# EasyEDA Pro project 基于VL6180的接近检测系统设计.eprj

# Schematic VL6180驱动板
Create Date: 2023-04-27; Page Name: 2/2; Project Name: 基于VL6180的接近检测系统设计; Schematic Name: VL6180驱动板; Update Date: 2023-05-16; Company: 高生洋; Drawed: B19030405; Page Size: A4; Version: V1.0
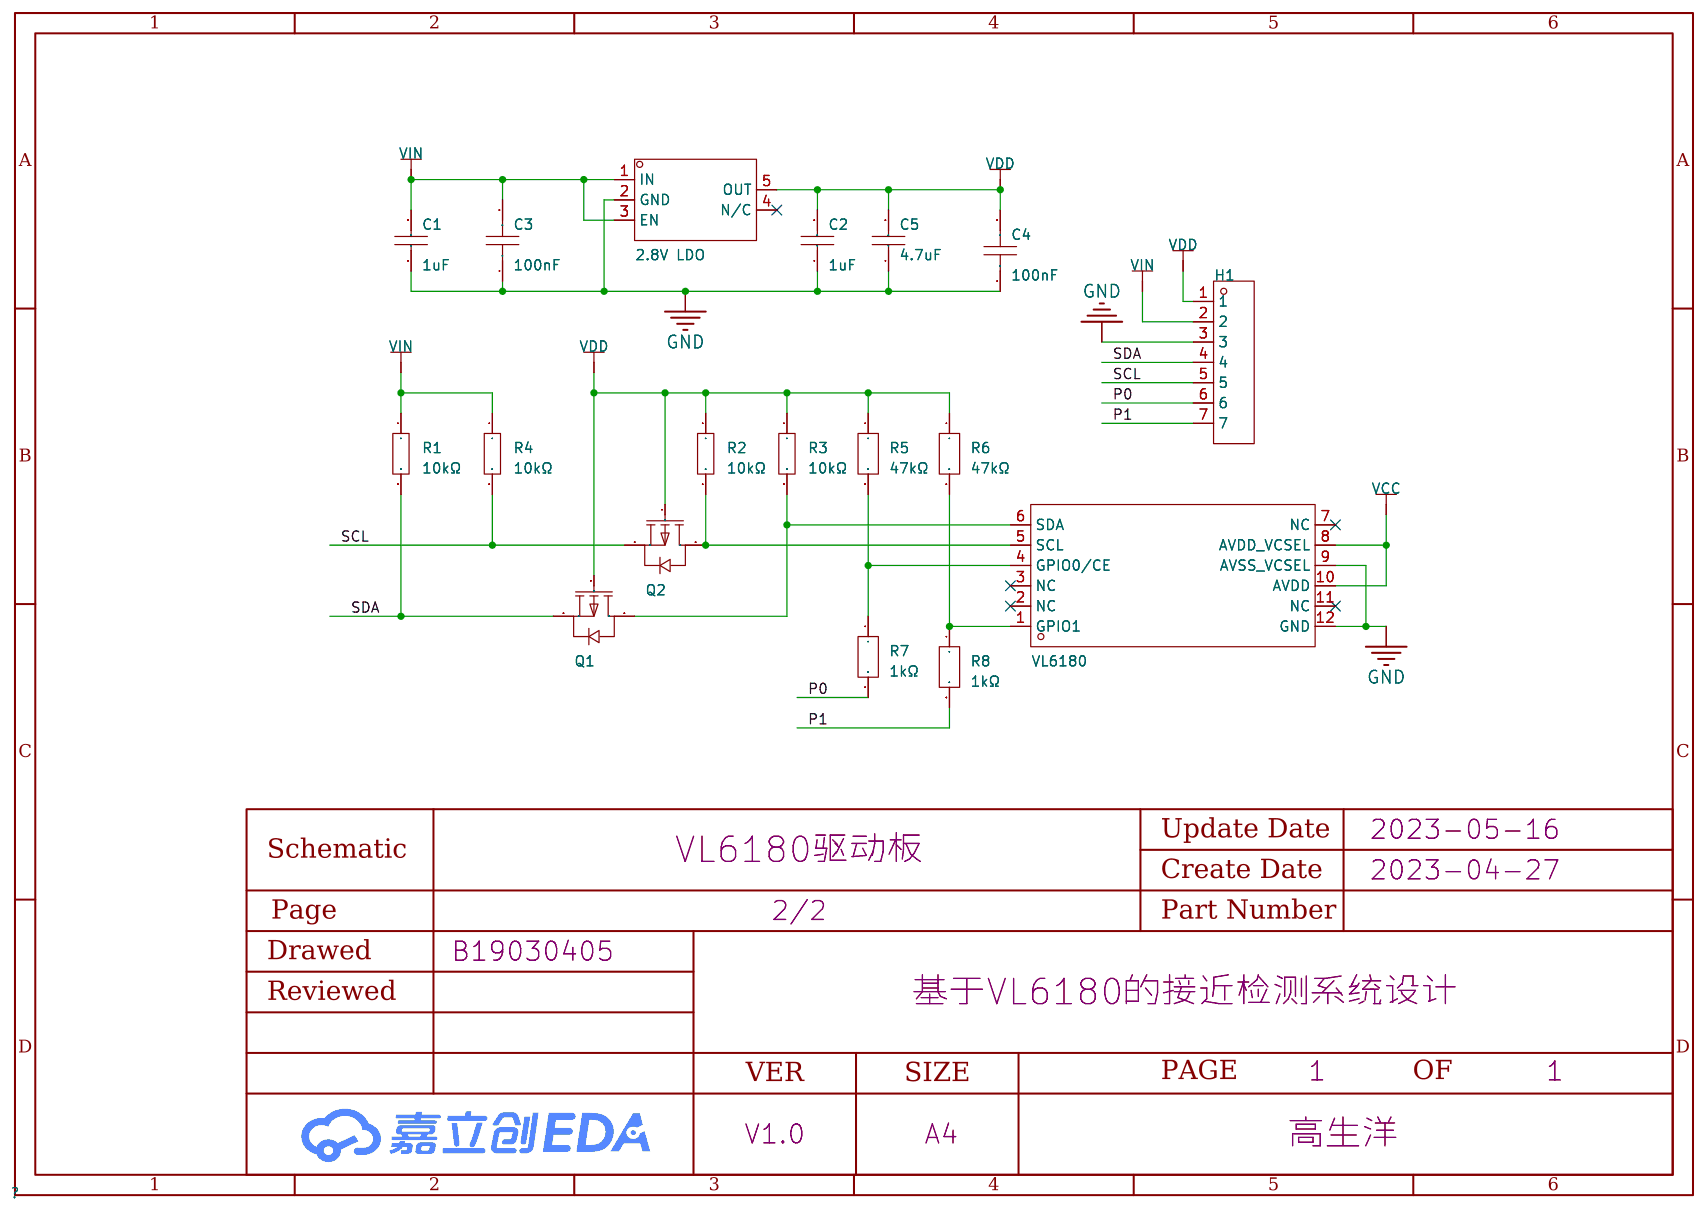
[diagram p0: schematic sheet]

## Parts
C1  1uF  [C0603]
C2  1uF  [C0603]
C3  100nF  [C0603]
C4  100nF  [C0603]
C5  4.7uF  [C0805]
H1  PZ254V-11-07P  [HDR-TH_7P-P2.54-V-M]
Q1  AO3401  [SOT-23-3_L2.9-W1.4-P1.90-LS2.6-BR]
Q2  AO3401  [SOT-23-3_L2.9-W1.4-P1.90-LS2.6-BR]
R1  10kΩ  [R0603]
R2  10kΩ  [R0603]
R3  10kΩ  [R0603]
R4  10kΩ  [R0603]
R5  47kΩ  [R0805]
R6  47kΩ  [R0805]
R7  1kΩ  [R0805]
R8  1kΩ  [R0805]
U1  VL6180  [LGA-12_L4.8-W2.8-P0.75-BL]
U2  2.8V LDO  [TSOT-23-5_L2.9-W1.6-P0.95-LS2.8-BL]

## Library data of the parts
C1 C2 = CL10A105KO8NNNC: 容值:1uF;精度:±10%;额定电压:16V;材质(温度系数):X5R;; LCSC Part Name: 1uF ±10% 16V; Supplier Part: C1592; Manufacturer: SAMSUNG(三星); Supplier Footprint: 0603; JLCPCB Part Class: Extended Part; Datasheet: https://atta.szlcsc.com/upload/public/pdf/source/20220919/9FBE606BE0D9532D730F292EB26DC5BB.pdf; Supplier: LCSC; Tolerance: ±10%; Voltage Rated: 16V; Temperature Coefficient: X5R
C3 C4 = CL10B104KB8NNNC: 容值:100nF;精度:±10%;额定电压:50V;材质(温度系数):X7R;; LCSC Part Name: 100nF ±10% 50V; Supplier Part: C1591; Manufacturer: SAMSUNG(三星); Supplier Footprint: 0603; JLCPCB Part Class: Extended Part; Datasheet: https://atta.szlcsc.com/upload/public/pdf/source/20160103/1457707680512.pdf; Supplier: LCSC; Tolerance: ±10%; Voltage Rated: 50V; Temperature Coefficient: X7R
C5 = CL21A475KAQNNNE: 容值:4.7uF;精度:±10%;额定电压:25V;材质(温度系数):X5R;; LCSC Part Name: 4.7uF ±10% 25V; Supplier Part: C1779; Manufacturer: SAMSUNG(三星); Supplier Footprint: 0805; JLCPCB Part Class: Basic Part; Datasheet: https://atta.szlcsc.com/upload/public/pdf/source/20160103/1457707696447.pdf; Supplier: LCSC; Tolerance: ±10%; Voltage Rated: 25V; Temperature Coefficient: X5R
H1 = PZ254V-11-07P: 排数:单排;总PIN位数:7;间距:2.54mm;插针结构:1x7P;行距:-;安装类型:直插;圆针/方针:方针;额定电流:-;额定电压:-;配合针长度:6mm;塑高:2.5mm;端接针长度:3mm;触头材质:黄铜;触头镀层:-;工作温度范围:-40℃~+105℃;颜色:黑色;; LCSC Part Name: 2.54mm 1x7P 直插 方针; Supplier Part: C492406; Manufacturer: XFCN(兴飞); Supplier Footprint: 直插,P=2.54mm; JLCPCB Part Class: Extended Part; Datasheet: https://atta.szlcsc.com/upload/public/pdf/source/20200309/C492406_654C533EE691117E22DD9F76C114C2D9.pdf; Supplier: LCSC; Number of Rows: 单排; Number of Pins: 7; Pitch: 2.54mm; Pin Structure: 1x7P; Mounting Type: 直插; Circluar Pins/Square Pins: 方针; Length of Mating Pin: 6mm; Insulation Height: 2.5mm; Length of End Connection Pin: 3mm; Contact Material: 黄铜; Operating Temperature Range: -40℃~+105℃; Color: 黑色
Q1 Q2 = AO3401_C727156: 类型:P沟道;漏源电压(Vdss):30V;连续漏极电流(Id):4.2A;功率(Pd):350mW;导通电阻(RDS(on)@Vgs,Id):65mΩ@10V,4.2A;阈值电压(Vgs(th)@Id):1.3V@250uA;栅极电荷(Qg@Vgs):-;输入电容(Ciss@Vds):-;反向传输电容(Crss@Vds):-;工作温度:-;; LCSC Part Name: P沟道 30V 4.2A; Supplier Part: C727156; Manufacturer: TWGMC(台湾迪嘉); Supplier Footprint: SOT-23; JLCPCB Part Class: Extended Part; Datasheet: https://atta.szlcsc.com/upload/public/pdf/source/20200827/C727156_6E081BBEEFBC6B8FEE164CB196B0AF30.pdf; Supplier: LCSC; Type: P沟道; Drain Source Voltage (Vdss): 30V; Continuous Drain Current (Id): 4.2A; Power Dissipation (Pd): 350mW; Drain Source On Resistance (RDS(on)@Vgs,Id): 65mΩ@10V,4.2A; Gate Threshold Voltage (Vgs(th)@Id): 1.3V@250uA
R1-R4 = ERJPB3B1002V: 电阻类型:厚膜电阻;阻值:10kΩ;精度:±0.1%;功率:200mW;温度系数:±50ppm/℃;最大工作电压:200V;工作温度范围:-55℃~+155℃;; LCSC Part Name: 10kΩ ±0.1% 200mW; Supplier Part: C161787; Manufacturer: PANASONIC(松下); Supplier Footprint: 0603; JLCPCB Part Class: Extended Part; Datasheet: https://atta.szlcsc.com/upload/public/pdf/source/20180125/C161787_15168649453061302830.pdf; Supplier: LCSC; Type: 厚膜电阻; Tolerance: ±0.1%; Power(Watts): 200mW; Temperature Coefficient: ±50ppm/℃; Overload Voltage (Max): 200V; Operating Temperature Range: -55℃~+155℃
R5 R6 = ERJ6ENF4702V: 阻值:47kΩ;精度:±1%;功率:125mW;; LCSC Part Name: 47kΩ ±1% 125mW; Supplier Part: C413309; Manufacturer: PANASONIC(松下); Supplier Footprint: 0805; JLCPCB Part Class: Extended Part; Datasheet: https://atta.szlcsc.com/upload/public/pdf/source/20190821/C413309_39F3A1D8F82115A0DE44DA13FCDC7334.pdf; Supplier: LCSC; Tolerance: ±1%; Power(Watts): 125mW; Temperature Coefficient: ±100ppm/℃; Operating Temperature Range: -55℃~+155℃
R7 R8 = ERJPB6B1001V: 阻值:1kΩ;精度:±0.1%;功率:250mW;; LCSC Part Name: 1kΩ ±0.1% 250mW; Supplier Part: C413712; Manufacturer: PANASONIC(松下); Supplier Footprint: 0805; JLCPCB Part Class: Extended Part; Datasheet: https://atta.szlcsc.com/upload/public/pdf/source/20190821/C413712_16C6B59B4DECA51D4907C6F5D5BAEAA8.pdf; Supplier: LCSC; Tolerance: ±0.1%; Power(Watts): 250mW; Temperature Coefficient: ±50ppm/℃; Operating Temperature Range: -55℃~+155℃
U1 = VL6180V1NR/1: Supplier Part: C2655167; Manufacturer: ST(意法半导体); Supplier Footprint: SMD-12P; JLCPCB Part Class: Extended Part; Datasheet: https://atta.szlcsc.com/upload/public/pdf/source/20210601/445B6E214A1851E4E63FE7A9FF5CA4D1.pdf; Supplier: LCSC
U2 = LP5907MFX-2.8/NOPB: 输出类型:固定;输出极性:正;最大输入电压:5.5V;输出电压:2.8V;输出电流:250mA;电源纹波抑制比(PSRR):90dB;; LCSC Part Name: 输入5.5V 输出2.8V 250mA; Supplier Part: C186700; Manufacturer: TI(德州仪器); Supplier Footprint: SOT-23-5; JLCPCB Part Class: Extended Part; Datasheet: https://atta.szlcsc.com/upload/public/pdf/source/20180528/C186700_850804AA11B71FCEC3AC01A6D06F30A0.pdf; Supplier: LCSC; Output Type: 固定; Output Polarity: 正; Number of Outputs: 1; Maximum Input Voltage: 5.5V; Output Voltage: 2.8V; Dropout Voltage: 250mV@(250mA); Output Current: 250mA; Power Supply Rejection Ratio (PSRR): 90dB

## Nets
GND: C1.1 C2.1 C3.1 C4.1 C5.1 H1.3 U1.9(AVSS_VCSEL) U1.12(GND) U2.2(GND)
VCC: U1.8(AVDD_VCSEL) U1.10(AVDD)
VDD: C2.2 C4.2 C5.2 H1.1 Q1.1(G) Q2.1(G) R2.1 R3.1 R5.1 R6.1 U2.5(OUT)
VIN: C1.2 C3.2 H1.2 R1.1 R4.1 U2.1(IN) U2.3(EN)
P0: H1.6 R7.2
P1: H1.7 R8.2
SCL: H1.5 Q2.2(S) R4.2
SDA: H1.4 Q1.2(S) R1.2
$1N805: Q2.3(D) R2.2 U1.5(SCL)
$1N810: Q1.3(D) R3.2 U1.6(SDA)
$1N811: R5.2 R7.1 U1.4(GPIO0/CE)
$1N812: R6.2 R8.1 U1.1(GPIO1)

Not connected (* = marked no-connect by the designer): U1 2(NC)* 3(NC)* 7(NC)* 11(NC)*; U2 4(N/C)*

# Schematic 主控电路
Create Date: 2023-04-27; Page Name: 1/2; Project Name: 基于VL6180的接近检测系统设计; Schematic Name: 主控电路; Update Date: 2023-05-16; Company: 高生洋; Drawed: B19030405; Page Size: A4; Part Number: 1111111; Reviewed: 123456; Version: V1.0
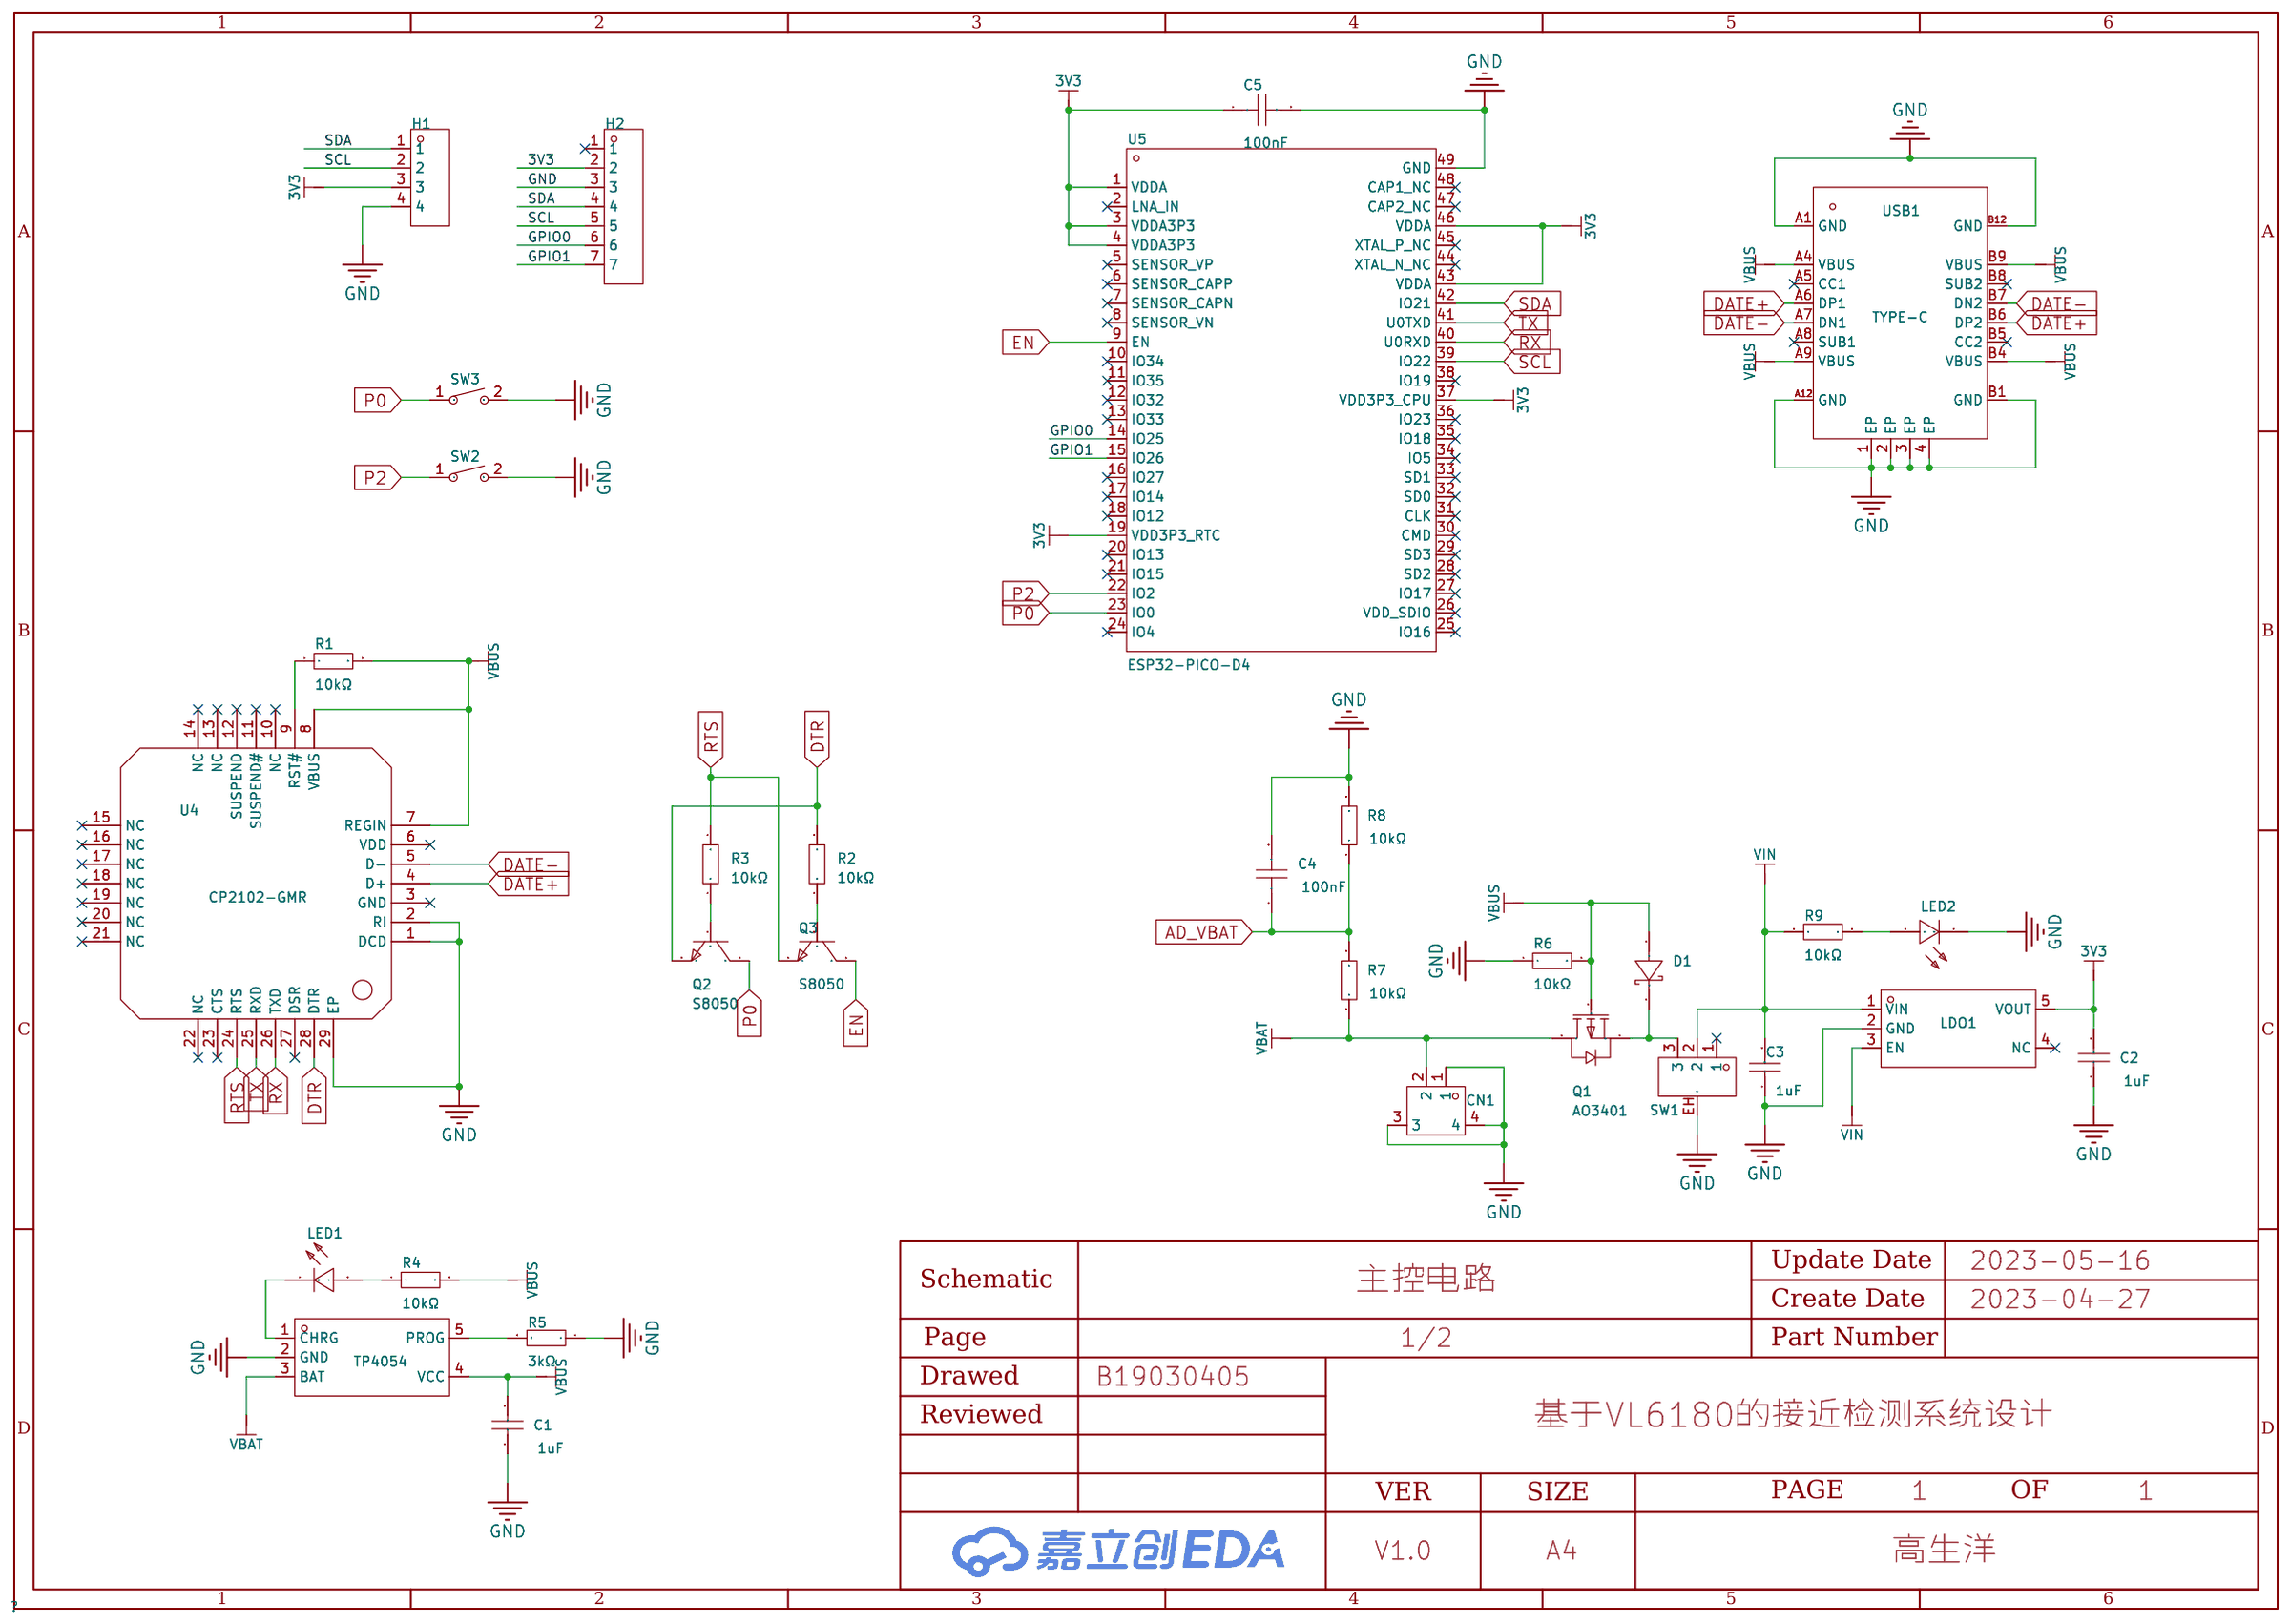
[diagram p1: schematic sheet]

## Parts
C1  1uF  [C0603]
C2  1uF  [C0603]
C3  1uF  [C0603]
C4  100nF  [C0603]
C5  100nF  [C0603]
CN1  HDGC2001WR-S-2P  [CONN-SMD_2P-P2.00_HDGC_HDGC2001WR-S-2P]
D1  1N5817W  [SOD-123_L2.8-W1.8-LS3.7-RD]
H1  PZ254V-11-04P  [HDR-TH_4P-P2.54-V-M]
H2  PZ254V-11-07P  [HDR-TH_7P-P2.54-V-M]
LDO1  MIC5504-3.3YM5-TR  [SOT-23-5_L3.0-W1.7-P0.95-LS2.8-TL]
LED1  19-217/GHC-YR1S2/3T  [LED0603-RD]
LED2  19-217/GHC-YR1S2/3T  [LED0603-RD]
Q1  AO3401  [SOT-23-3_L2.9-W1.4-P1.90-LS2.6-BR]
Q2  S8050  [SOT-23-3_L2.9-W1.3-P1.90-LS2.4-BR]
Q3  S8050  [SOT-23-3_L2.9-W1.3-P1.90-LS2.4-BR]
R1  10kΩ  [R0603]
R2  10kΩ  [R0603]
R3  10kΩ  [R0603]
R4  10kΩ  [R0603]
R5  3kΩ  [R0603]
R6  10kΩ  [R0603]
R7  10kΩ  [R0603]
R8  10kΩ  [R0603]
R9  10kΩ  [R0603]
SW1  SS-3292S-L2-B  [SW-SMD_SS-3292S-L2-B]
SW2  TS342A2P-WZ  [SW-SMD_L4.0-W2.9-LS5.0]
SW3  TS342A2P-WZ  [SW-SMD_L4.0-W2.9-LS5.0]
TP4054  TP4054-42-SOT25R  [SOT-23-5_L3.0-W1.7-P0.95-LS2.8-BL]
U4  CP2102-GMR  [WQFN-28_L5.0-W5.0-P0.50-BL-EP3.2]
U5  ESP32-PICO-D4  [LGA-48_L7.0-W7.0-P0.50-BL-EP5.4]
USB1  TYPE-C  [USB-C-SMD_KH-TYPE-C-16P]

## Library data of the parts
C1-C3 = CL10A105KB8NNNC: 容值:1uF;精度:±10%;额定电压:50V;材质(温度系数):X5R;; LCSC Part Name: 1uF ±10% 50V; Supplier Part: C15849; Manufacturer: SAMSUNG(三星); Supplier Footprint: 0603; JLCPCB Part Class: Basic Part; Datasheet: https://atta.szlcsc.com/upload/public/pdf/source/20160103/1457707679084.pdf; Supplier: LCSC; Tolerance: ±10%; Voltage Rated: 50V; Temperature Coefficient: X5R
C4 = CL10B104KC8NNNC: 容值:100nF;精度:±10%;额定电压:100V;材质(温度系数):X7R;; LCSC Part Name: 100nF ±10% 100V; Supplier Part: C15725; Manufacturer: SAMSUNG(三星); Supplier Footprint: 0603; JLCPCB Part Class: Extended Part; Datasheet: https://atta.szlcsc.com/upload/public/pdf/source/20160103/1457707678663.pdf; Supplier: LCSC; Tolerance: ±10%; Voltage Rated: 100V; Temperature Coefficient: X7R
C5 = CL10B104KB8NNNC: 容值:100nF;精度:±10%;额定电压:50V;材质(温度系数):X7R;; LCSC Part Name: 100nF ±10% 50V; Supplier Part: C1591; Manufacturer: SAMSUNG(三星); Supplier Footprint: 0603; JLCPCB Part Class: Extended Part; Datasheet: https://atta.szlcsc.com/upload/public/pdf/source/20160103/1457707680512.pdf; Supplier: LCSC; Tolerance: ±10%; Voltage Rated: 50V; Temperature Coefficient: X7R
CN1 = HDGC2001WR-S-2P: PH2.0针座卧贴 2P; LCSC Part Name: PH2.0针座卧贴 2P; Supplier Part: C2936224; Manufacturer: HDGC(华德共创); Supplier Footprint: SMD,P=2mm; JLCPCB Part Class: Extended Part; Datasheet: https://atta.szlcsc.com/upload/public/pdf/source/20211224/97C496F606ECD8881F21462B7EF9EC10.pdf; Supplier: LCSC
D1 = 1N5817W: 二极管配置:独立式;直流反向耐压(Vr):20V;平均整流电流(Io):1A;正向压降(Vf):750mV@3A;反向电流(Ir):1mA@20V;; LCSC Part Name: 20V 1A 750mV@3A; Supplier Part: C727113; Manufacturer: TWGMC(台湾迪嘉); Supplier Footprint: SOD-123; JLCPCB Part Class: Extended Part; Datasheet: https://atta.szlcsc.com/upload/public/pdf/source/20200828/C727113_260B72EC53C389C21DF1E8AB243F1BFC.pdf; Supplier: LCSC; Diode Configuration: 独立式; Reverse Voltage (Vr): 20V; Average Rectified Current (Io): 1A; Forward Voltage (Vf@If): 750mV@3A; Reverse Leakage Current (Ir): 1mA@20V
H1 = PZ254V-11-04P: 排数:单排;总PIN位数:4;间距:2.54mm;插针结构:1x4P;行距:-;安装类型:直插;圆针/方针:方针;额定电流:3A;额定电压:250V;配合针长度:6mm;塑高:2.5mm;端接针长度:3mm;触头材质:-;工作温度范围:-40℃~+105℃;颜色:黑色;; LCSC Part Name: 2.54mm 1x4P 直插 方针; Supplier Part: C2691448; Manufacturer: XFCN(兴飞); Supplier Footprint: 直插,P=2.54mm; JLCPCB Part Class: Extended Part; Datasheet: https://atta.szlcsc.com/upload/public/pdf/source/20200309/C492403_F9F19131791D08044AD4F84F8E751A34.pdf; Supplier: LCSC; Number of Rows: 单排; Number of Pins: 4; Pitch: 2.54mm; Pin Structure: 1x4P; Mounting Type: 直插; Circluar Pins/Square Pins: 方针; Current Rating (Max): 3A; Voltage Rating (Max): 250V; Length of Mating Pin: 6mm; Insulation Height: 2.5mm; Length of End Connection Pin: 3mm; Operating Temperature Range: -40℃~+105℃; Color: 黑色
H2 = PZ254V-11-07P: 排数:单排;总PIN位数:7;间距:2.54mm;插针结构:1x7P;行距:-;安装类型:直插;圆针/方针:方针;额定电流:-;额定电压:-;配合针长度:6mm;塑高:2.5mm;端接针长度:3mm;触头材质:黄铜;触头镀层:-;工作温度范围:-40℃~+105℃;颜色:黑色;; LCSC Part Name: 2.54mm 1x7P 直插 方针; Supplier Part: C492406; Manufacturer: XFCN(兴飞); Supplier Footprint: 直插,P=2.54mm; JLCPCB Part Class: Extended Part; Datasheet: https://atta.szlcsc.com/upload/public/pdf/source/20200309/C492406_654C533EE691117E22DD9F76C114C2D9.pdf; Supplier: LCSC; Number of Rows: 单排; Number of Pins: 7; Pitch: 2.54mm; Pin Structure: 1x7P; Mounting Type: 直插; Circluar Pins/Square Pins: 方针; Length of Mating Pin: 6mm; Insulation Height: 2.5mm; Length of End Connection Pin: 3mm; Contact Material: 黄铜; Operating Temperature Range: -40℃~+105℃; Color: 黑色
LDO1 = MIC5504-3.3YM5-TR: 输出类型:固定;输出极性:正;输出通道数:1;最大输入电压:5.5V;输出电压:3.3V;压差:380mV@(300mA);输出电流:300mA;电源纹波抑制比(PSRR):60dB@(1kHz);; LCSC Part Name: 正 Vin=5.5V Vout=3.3V 300mA 60dB@(1kHz); Supplier Part: C88419; Manufacturer: MICROCHIP(美国微芯); Supplier Footprint: SOT-23-5; JLCPCB Part Class: Extended Part; Datasheet: https://atta.szlcsc.com/upload/public/pdf/source/20171228/C88419_15144476511281215102.pdf; Supplier: LCSC; Output Type: 固定; Output Polarity: 正; Number of Outputs: 1; Maximum Input Voltage: 5.5V; Output Voltage: 3.3V; Dropout Voltage: 380mV@(300mA); Output Current: 300mA; Power Supply Rejection Ratio (PSRR): 60dB@(1kHz)
LED1 LED2 = 19-217/GHC-YR1S2/3T: 发光颜色:翠绿;二极管配置:-;透镜颜色:无色透明;主波长:520nm~535nm;峰值波长:518nm;色温:-;测试电流:20mA;功率:110mW;发光角度:120°;安装方式:-;工作温度:-40℃~+85℃;; LCSC Part Name: 翠绿 520nm~535nm; Supplier Part: C72043; Manufacturer: EVERLIGHT(亿光); Supplier Footprint: 0603; JLCPCB Part Class: Basic Part; Datasheet: https://atta.szlcsc.com/upload/public/pdf/source/20160507/1462613613780.pdf; Supplier: LCSC; Emitted Color: 翠绿; Lens Color: 无色透明; Dominant Wavelength: 520nm~535nm; Peak Wavelength: 518nm; Forward Current: 20mA; Power Dissipation: 110mW; Viewing Angle: 120°; Operating Temperature: -40℃~+85℃
Q1 = AO3401_C727156: 类型:P沟道;漏源电压(Vdss):30V;连续漏极电流(Id):4.2A;功率(Pd):350mW;导通电阻(RDS(on)@Vgs,Id):65mΩ@10V,4.2A;阈值电压(Vgs(th)@Id):1.3V@250uA;栅极电荷(Qg@Vgs):-;输入电容(Ciss@Vds):-;反向传输电容(Crss@Vds):-;工作温度:-;; LCSC Part Name: P沟道 30V 4.2A; Supplier Part: C727156; Manufacturer: TWGMC(台湾迪嘉); Supplier Footprint: SOT-23; JLCPCB Part Class: Extended Part; Datasheet: https://atta.szlcsc.com/upload/public/pdf/source/20200827/C727156_6E081BBEEFBC6B8FEE164CB196B0AF30.pdf; Supplier: LCSC; Type: P沟道; Drain Source Voltage (Vdss): 30V; Continuous Drain Current (Id): 4.2A; Power Dissipation (Pd): 350mW; Drain Source On Resistance (RDS(on)@Vgs,Id): 65mΩ@10V,4.2A; Gate Threshold Voltage (Vgs(th)@Id): 1.3V@250uA
Q2 Q3 = S8050_C2688231: 晶体管类型:NPN;集射极击穿电压(Vceo):25V;集电极电流(Ic):800mA;功率(Pd):350mW;集电极-发射极饱和电压(VCE(sat)@Ic,Ib):600mV@500mA,50mA;直流电流增益(hFE@Ic,Vce):200@50mA,1V;特征频率(fT):150MHz;工作温度:+150℃@(Tj);; Supplier Part: C2688231; Manufacturer: WPMtek(维攀微); Supplier Footprint: SOT-23; JLCPCB Part Class: Extended Part; Datasheet: https://atta.szlcsc.com/upload/public/pdf/source/20210222/C2688231_A300D69B63960DEEA81943DA6762DFE1.pdf; Supplier: LCSC; Transistor Type: NPN; Collector-Emitter Breakdown Voltage (Vceo): 25V; Collector Current (Ic): 800mA; Power Dissipation (Pd): 350mW; Collector-Emitter Saturation Voltage (VCE(sat)@Ic,Ib): 600mV@500mA,50mA; DC Current Gain (hFE@Ic,Vce): 200@50mA,1V; Transition Frequency (fT): 150MHz; Operating Temperature: +150℃@(Tj)
R1-R4 R9 = RTT031002FTP: 电阻类型:厚膜电阻;阻值:10kΩ;精度:±1%;功率:100mW;温度系数:±100ppm/℃;最大工作电压:75V;工作温度范围:-55℃~+155℃;; LCSC Part Name: 10kΩ ±1% 100mW; Supplier Part: C103199; Manufacturer: RALEC(旺诠); Supplier Footprint: 0603; JLCPCB Part Class: Extended Part; Datasheet: https://atta.szlcsc.com/upload/public/pdf/source/20170408/1491642779583.pdf; Supplier: LCSC; Type: 厚膜电阻; Tolerance: ±1%; Power(Watts): 100mW; Temperature Coefficient: ±100ppm/℃; Overload Voltage (Max): 75V; Operating Temperature Range: -55℃~+155℃
R5 = 0603WAF3001T5E: 电阻类型:厚膜电阻;阻值:3kΩ;精度:±1%;功率:100mW;温度系数:±100ppm/℃;最大工作电压:75V;工作温度范围:-55℃~+155℃;; LCSC Part Name: 3kΩ ±1% 100mW; Supplier Part: C4211; Manufacturer: UNI-ROYAL(厚声); Supplier Footprint: 0603; JLCPCB Part Class: Basic Part; Datasheet: https://atta.szlcsc.com/upload/public/pdf/source/20200306/C422600_1E6D84923E4A46A82E41ADD87F860B5C.pdf; Supplier: LCSC; Type: 厚膜电阻; Tolerance: ±1%; Power(Watts): 100mW; Temperature Coefficient: ±100ppm/℃; Overload Voltage (Max): 75V; Operating Temperature Range: -55℃~+155℃
R6-R8 = ERJPB3B1002V: 电阻类型:厚膜电阻;阻值:10kΩ;精度:±0.1%;功率:200mW;温度系数:±50ppm/℃;最大工作电压:200V;工作温度范围:-55℃~+155℃;; LCSC Part Name: 10kΩ ±0.1% 200mW; Supplier Part: C161787; Manufacturer: PANASONIC(松下); Supplier Footprint: 0603; JLCPCB Part Class: Extended Part; Datasheet: https://atta.szlcsc.com/upload/public/pdf/source/20180125/C161787_15168649453061302830.pdf; Supplier: LCSC; Type: 厚膜电阻; Tolerance: ±0.1%; Power(Watts): 200mW; Temperature Coefficient: ±50ppm/℃; Overload Voltage (Max): 200V; Operating Temperature Range: -55℃~+155℃
SW1 = SS-3292S-L2-B: 额定电流(DC):50mA;额定电压(DC):12V;额定电流(AC):50mA;额定电压(AC):12V;电路结构:单刀双掷;安装方式:卧贴;机械寿命:10000;开关颜色:黑色;滑钮形状:矩形柱状;引脚样式:SMD接片;工作温度:-40℃~+85℃;开关长度:6.75mm;开关宽度:8.8mm;开关高度:1.4mm;; LCSC Part Name: 立式贴片七脚两档小拨动开关 W6.6xD2.7xH1.4H黑色柄高2.0MM; Supplier Part: C500057; Manufacturer: XKB Connectivity(中国星坤); Supplier Footprint: SMD; JLCPCB Part Class: Extended Part; Datasheet: https://atta.szlcsc.com/upload/public/pdf/source/20211009/537369D6D18B021A8BA9BB670E121839.pdf; Supplier: LCSC; Current Rating (DC): 50mA; Voltage Rating (DC): 12V; Current Rating (AC): 50mA; Voltage Rating (AC): 12V; Circuit: 单刀双掷; Mounting Style: 卧贴; Mechanical Life: 10000; Actuator Color: 黑色; Actuator Style: 矩形柱状; Pin Style: SMD接片; Operating Temperature: -40℃~+85℃; Switch Length: 6.75mm; Switch Width: 8.8mm; Switch Height: 1.4mm
SW2 SW3 = TS342A2P-WZ: 触点电流:50mA;额定电压(DC):12V;绝缘电阻:100MΩ;电路结构:单刀单掷;安装方式:立贴;按钮形状:圆形按钮;按钮/盖帽颜色:黑色;机械寿命:30000;工作温度:-25℃~+70℃;引脚样式:SMD接片;开关长度:3.95mm;开关宽度:2.9mm;开关高度:2mm;带支架:否;; LCSC Part Name: 轻触开关 3*4*2 两脚小龟不带柱 250gf 黑色塑胶按钮; Supplier Part: C557591; Manufacturer: SHOU HAN(首韩); Supplier Footprint: SMD; JLCPCB Part Class: Extended Part; Datasheet: https://atta.szlcsc.com/upload/public/pdf/source/20200519/C557591_B3A5A21584733303F06306F18577DA8B.pdf; Supplier: LCSC; Contact Current: 50mA; Voltage Rating (DC): 12V; Insulation Resistance: 100MΩ; Circuit: 单刀单掷; Mounting Style: 立贴; Actuator Style: 圆形按钮; Actuator/Cap Color: 黑色; Mechanical Life: 30000; Operating Temperature: -25℃~+70℃; Pin Style: SMD接片; Switch Length: 3.95mm; Switch Width: 2.9mm; Switch Height: 2mm; Strike Gundam: 否
TP4054 = TP4054-42-SOT25R: 锂电池充电管理芯片; Supplier Part: C32574; Manufacturer: TOPPOWER(南京拓微); Supplier Footprint: SOT-23-5; JLCPCB Part Class: Basic Part; Datasheet: https://atta.szlcsc.com/upload/public/pdf/source/20140621/1457707095588.pdf; Supplier: LCSC
U4 = CP2102-GMR: 类型:Transceiver;协议类别:USB;驱动器/接收器数:1/1;数据速率:1Mbps;; Supplier Part: C6568; Manufacturer: SILICON LABS(芯科); Supplier Footprint: QFN-28(5x5); JLCPCB Part Class: Basic Part; Datasheet: https://atta.szlcsc.com/upload/public/pdf/source/20170103/1483439882795.pdf; Supplier: LCSC; Type: Transceiver; Protocol: USB; Number of Drivers/Receivers: 1/1; Data Rate: 1Mbps; Supply Voltage: 3V ~ 3.6V
U5 = ESP32-PICO-D4: 功能:WiFi, 蓝牙;工作电压:2.7V~3.6V;通信频率:2.4GHz~2.5GHz;接口类型:ADC, SDIO, SPI, PWM, UART, I2C, I2S, GPIO;模式:-;工作温度:-40℃~+85℃;; Supplier Part: C193707; Manufacturer: ESPRESSIF(乐鑫); Supplier Footprint: QFN-48(7x7); JLCPCB Part Class: Extended Part; Datasheet: https://atta.szlcsc.com/upload/public/pdf/source/20180531/C193707_20E6BADDB6EC95F0C0D505BA515D2866.pdf; Supplier: LCSC; Function: WiFi, 蓝牙; Operating Voltage: 2.7V~3.6V; Frequency Of Communication: 2.4GHz~2.5GHz; Serial Interfaces: ADC, SDIO, SPI, PWM, UART, I2C, I2S, GPIO; Operating Temperature: -40℃~+85℃
USB1 = KH-TYPE-C-16P: 连接器类型:Type-C;标准:-;公母:母座;触点数量:16;端口数量:1;安装方式:卧贴;额定电流 - 电源:3A;工作温度范围:-40℃~+85℃;; LCSC Part Name: Type-C 母座 卧贴; Supplier Part: C709357; Manufacturer: kinghelm(金航标); Supplier Footprint: SMD; JLCPCB Part Class: Extended Part; Datasheet: https://atta.szlcsc.com/upload/public/pdf/source/20200911/C709357_AA8DCEB38BB20E3035A7ED7AE7667837.pdf; Supplier: LCSC; Connector Type: Type-C; Gender: 母座; Number of Contacts: 16; Number of Ports: 1; Mounting Style: 卧贴; Current Rating - Power (Max): 3A; Operating Temperature Range: -40℃~+85℃; Check: false

## Nets
3V3: C2.2 C5.1 H1.3 H2.2 LDO1.5(VOUT) U5.1(VDDA) U5.3(VDDA3P3) U5.4(VDDA3P3) U5.19(VDD3P3_RTC) U5.37(VDD3P3_CPU) U5.43(VDDA) U5.46(VDDA)
GND: C1.1 C2.1 C3.1 C4.2 C5.2 CN1.1 CN1.3 CN1.4 H1.4 H2.3 LDO1.2(GND) LED2.1(C) R5.1 R6.1 R8.2 SW1.EH SW2.2 SW3.2 TP4054.2(GND) U4.1(DCD) U4.2(RI) U4.29(EP) U5.49(GND) USB1.1(EP) USB1.2(EP) USB1.3(EP) USB1.4(EP) USB1.A1(GND) USB1.A12(GND) USB1.B1(GND) USB1.B12(GND)
VBAT: CN1.2 Q1.3(D) R7.1 TP4054.3(BAT)
VBUS: C1.2 D1.2(A) Q1.1(G) R1.2 R4.2 R6.2 TP4054.4(VCC) U4.7(REGIN) U4.8(VBUS) USB1.A4(VBUS) USB1.A9(VBUS) USB1.B4(VBUS) USB1.B9(VBUS)
VIN: C3.2 LDO1.1(VIN) LDO1.3(EN) R9.1 SW1.2
AD_VBAT: C4.1 R7.2 R8.1
DATE+: U4.4(D+) USB1.A6(DP1) USB1.B6(DP2)
DATE-: U4.5(D-) USB1.A7(DN1) USB1.B7(DN2)
DTR: Q2.2(E) R2.2 U4.28(DTR)
EN: Q3.3(C) U5.9(EN)
GPIO0: H2.6 U5.14(IO25)
GPIO1: H2.7 U5.15(IO26)
P0: Q2.3(C) SW3.1 U5.23(IO0)
P2: SW2.1 U5.22(IO2)
RTS: Q3.2(E) R3.2 U4.24(RTS)
RX: U4.26(TXD) U5.40(U0RXD)
SCL: H1.2 H2.5 U5.39(IO22)
SDA: H1.1 H2.4 U5.42(IO21)
TX: U4.25(RXD) U5.41(U0TXD)
$1N2478: LED1.2(A) R4.1
$1N2479: LED1.1(C) TP4054.1(CHRG)
$1N2483: R5.2 TP4054.5(PROG)
$1N2492: D1.1(C) Q1.2(S) SW1.3
$1N2500: LED2.2(A) R9.2
$1N2512: R1.1 U4.9(RST#)
$1N2515: Q3.1(B) R2.1
$1N2518: Q2.1(B) R3.1

Not connected (* = marked no-connect by the designer): H2 1*; LDO1 4(NC)*; SW1 1*; U4 3(GND)* 6(VDD)* 10(NC)* 11(SUSPEND#)* 12(SUSPEND)* 13(NC)* 14(NC)* 15(NC)* 16(NC)* 17(NC)* 18(NC)* 19(NC)* 20(NC)* 21(NC)* 22(NC)* 23(CTS)* 27(DSR)*; U5 2(LNA_IN)* 5(SENSOR_VP)* 6(SENSOR_CAPP)* 7(SENSOR_CAPN)* 8(SENSOR_VN)* 10(IO34)* 11(IO35)* 12(IO32)* 13(IO33)* 16(IO27)* 17(IO14)* 18(IO12)* 20(IO13)* 21(IO15)* 24(IO4)* 25(IO16)* 26(VDD_SDIO)* 27(IO17)* 28(SD2)* 29(SD3)* 30(CMD)* 31(CLK)* 32(SD0)* 33(SD1)* 34(IO5)* 35(IO18)* 36(IO23)* 38(IO19)* 44(XTAL_N_NC)* 45(XTAL_P_NC)* 47(CAP2_NC)* 48(CAP1_NC)*; USB1 A5(CC1)* A8(SUB1)* B5(CC2)* B8(SUB2)*

# Board VL6180
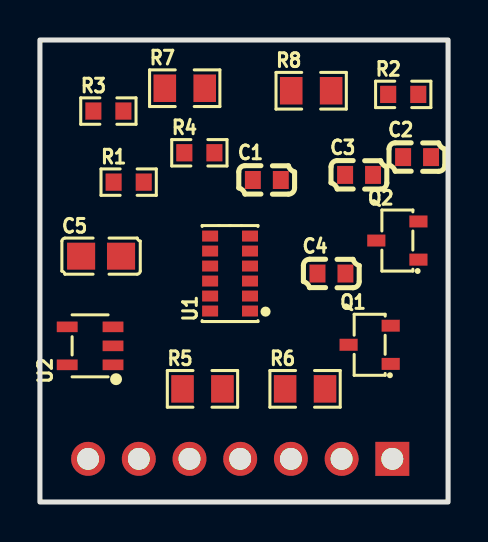
[diagram p2: board, top side]
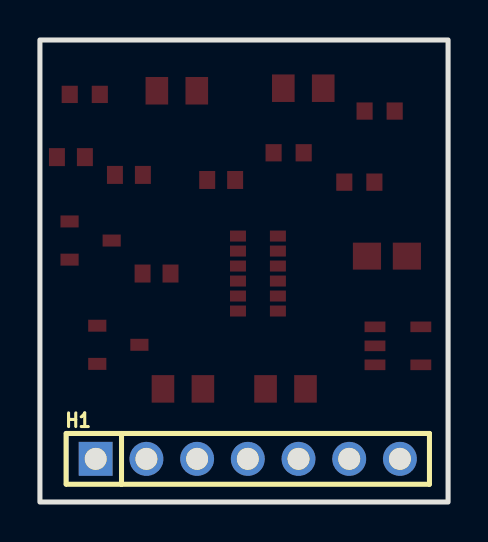
[diagram p3: board, bottom side, seen from below]

Outline 20.45 x 23.11 mm; copper layers: Top Layer, Bottom Layer. Coordinates in mm from the lower left corner of the outline.
Outline path: rectangle 0,23.11 20.45,0
Stack: Top Layer 0.035mm / Dielectric1 1.51mm FR4 er 4.5 / Bottom Layer 0.035mm

## Design rules (mm)
template: JLCPCB Capability(Two Layers Board)
spacing copperThickness1oz (default): track to track 0.102, other pairs 0.152 to 0.3
spacing copperThickness2oz: track to track 0.203, other pairs 0.152 to 0.3
track width copperThickness1oz (default): min 0.127, default 0.254, max 2.54
track width copperThickness2oz: min 0.203, default 0.254, max 2.54
differential pair differentialPair (default): width min 0.127, default 0.254, max 2.54; gap min 0.152, default 0.152
via viaSize (default): diameter min 0.5, default 0.61, max 10; hole min 0.3, default 0.305, max 6.3

## Placement (name value [footprint] x y rotation side)
C1  1uF  [C0603]  11.37 16.11 0 top
C2  1uF  [C0603]  18.89 17.25 0 top
C3  100nF  [C0603]  15.99 16.36 0 top
C4  100nF  [C0603]  14.6 11.43 0 top
C5  4.7uF  [C0805]  3.06 12.3 0 top
H1  PZ254V-11-07P  [HDR-TH_7P-P2.54-V-M]  10.03 2.16 180 bottom
Q1  AO3401  [SOT-23-3_L2.9-W1.4-P1.90-LS2.6-BR]  16.52 7.87 0 top
Q2  AO3401  [SOT-23-3_L2.9-W1.4-P1.90-LS2.6-BR]  17.91 13.08 0 top
R1  10kΩ  [R0603]  4.44 16 0 top
R2  10kΩ  [R0603]  18.2 20.39 0 top
R3  10kΩ  [R0603]  3.43 19.56 0 top
R4  10kΩ  [R0603]  7.99 17.47 0 top
R5  47kΩ  [R0805]  8.14 5.66 0 top
R6  47kΩ  [R0805]  13.28 5.66 0 top
R7  1kΩ  [R0805]  7.25 20.7 0 top
R8  1kΩ  [R0805]  13.59 20.57 0 top
U1  VL6180  [LGA-12_L4.8-W2.8-P0.75-BL]  9.53 11.43 90 top
U2  2.8V LDO  [TSOT-23-5_L2.9-W1.6-P0.95-LS2.8-BL]  2.51 7.81 90 top

## Footprints (pads in the part's own frame, mm; a bottom-side part is the same pattern mirrored in y, then rotated)
C0603
  rect 0.8x0.9 smd: 1(-0.7,0) 2(0.7,0)
C0805
  rect 1.41x1.35 smd: 1(-1,0) 2(1,0)
HDR-TH_7P-P2.54-V-M
  rect 1.7x1.7 hole 1.1: 1(-7.62,0)
  round 1.7 hole 1.1: 2(-5.08,0) 3(-2.54,0) 4(0,0) 5(2.54,0) 6(5.08,0) 7(7.62,0)
LGA-12_L4.8-W2.8-P0.75-BL
  rect 0.55x0.8 smd: 1(-1.875,-1) 2(-1.125,-1) 3(-0.375,-1) 4(0.375,-1) 5(1.125,-1) 6(1.875,-1) 7(1.875,1) 8(1.125,1) 9(0.375,1) 10(-0.375,1) 11(-1.125,1) 12(-1.875,1)
R0603
  rect 0.806x0.864 smd: 1(-0.753,0) 2(0.753,0)
R0805
  rect 1.133x1.377 smd: 1(-1,0) 2(1,0)
SOT-23-3_L2.9-W1.4-P1.90-LS2.6-BR
  rect 0.91x0.6 smd: 1(1.055,-0.955) 2(1.055,0.955) 3(-1.055,0)
TSOT-23-5_L2.9-W1.6-P0.95-LS2.8-BL
  rect 0.532x1.045 smd: 1(-0.95,-1.147) 2(0,-1.147) 3(0.95,-1.147) 4(0.95,1.147) 5(-0.95,1.147)

## Nets
As in the schematic.

Pads without a net: U1 2 3 7 11; U2 4

# Board ESP32
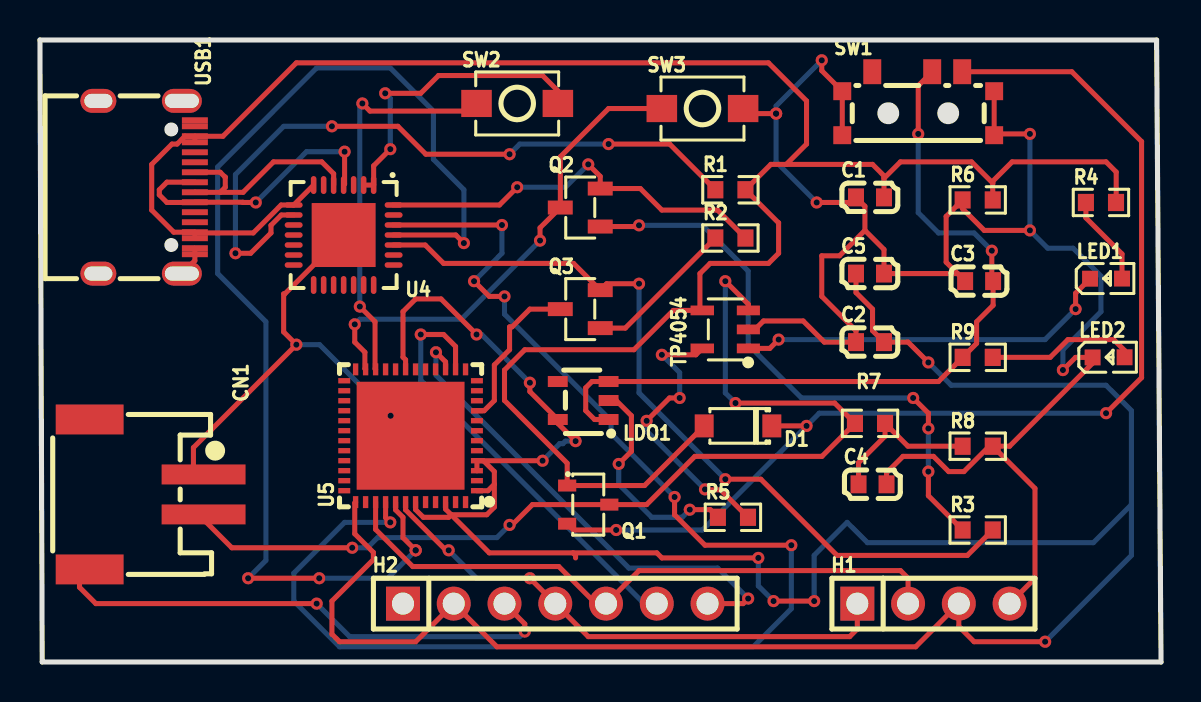
[diagram p4: board, top side]
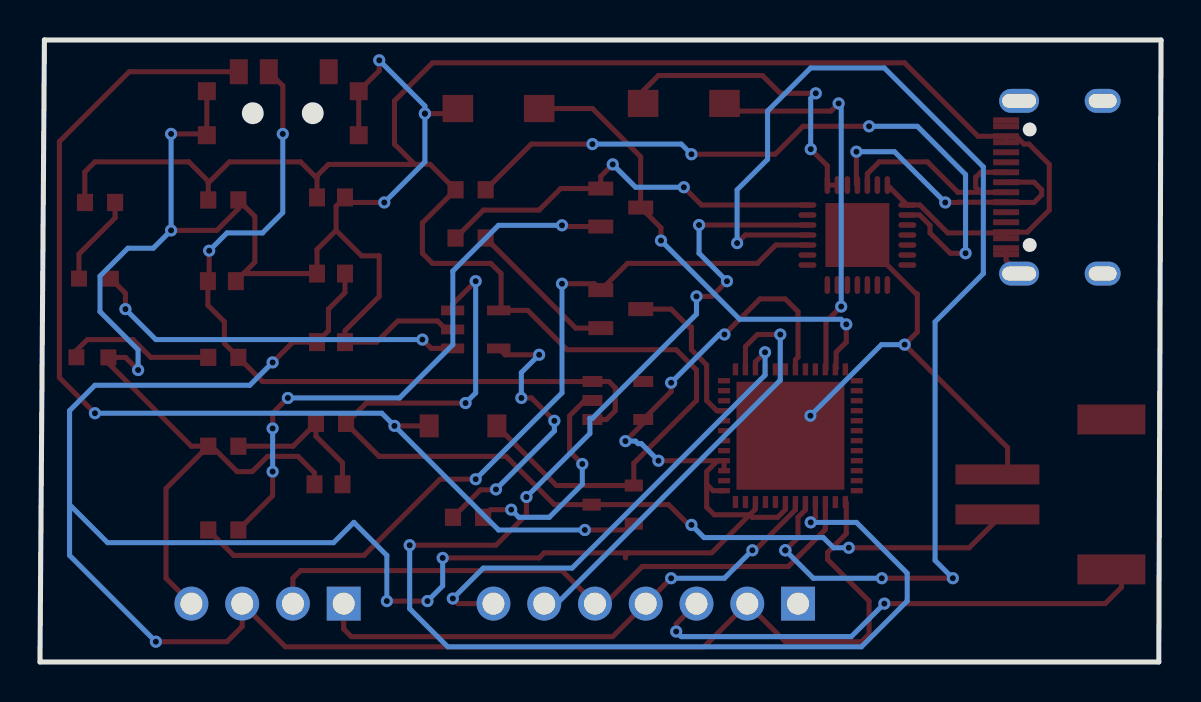
[diagram p5: board, bottom side, seen from below]

Outline 56.09 x 31.12 mm; copper layers: Top Layer, Bottom Layer. Coordinates in mm from the lower left corner of the outline.
Outline path: 0,31.12 0.11,0 56.09,0 55.87,31.12 0,31.12
Stack: Top Layer 0.035mm / Dielectric1 1.51mm FR4 er 4.5 / Bottom Layer 0.035mm

## Design rules (mm)
template: JLCPCB Capability(Two Layers Board)
spacing copperThickness1oz (default): track to track 0.102, other pairs 0.152 to 0.3
spacing copperThickness2oz: track to track 0.203, other pairs 0.152 to 0.3
track width copperThickness1oz (default): min 0.127, default 0.254, max 2.54
track width copperThickness2oz: min 0.203, default 0.254, max 2.54
differential pair differentialPair (default): width min 0.127, default 0.254, max 2.54; gap min 0.152, default 0.152
via viaSize (default): diameter min 0.5, default 0.61, max 10; hole min 0.3, default 0.305, max 6.3

## Placement (name value [footprint] x y rotation side)
C1  1uF  [C0603]  41.53 23.24 0 top
C2  1uF  [C0603]  41.53 16 0 top
C3  1uF  [C0603]  46.99 19.05 0 top
C4  100nF  [C0603]  41.66 8.89 0 top
C5  100nF  [C0603]  41.53 19.43 0 top
CN1  HDGC2001WR-S-2P  [CONN-SMD_2P-P2.00_HDGC_HDGC2001WR-S-2P]  5.34 8.38 270 top
D1  1N5817W  [SOD-123_L2.8-W1.8-LS3.7-RD]  34.93 11.81 180 top
H1  PZ254V-11-04P  [HDR-TH_4P-P2.54-V-M]  44.71 2.92 0 top
H2  PZ254V-11-07P  [HDR-TH_7P-P2.54-V-M]  25.78 2.92 0 top
LDO1  MIC5504-3.3YM5-TR  [SOT-23-5_L3.0-W1.7-P0.95-LS2.8-TL]  27.18 13.08 180 top
LED1  19-217/GHC-YR1S2/3T  [LED0603-RD]  53.34 19.18 0 top
LED2  19-217/GHC-YR1S2/3T  [LED0603-RD]  53.47 15.24 0 top
Q1  AO3401  [SOT-23-3_L2.9-W1.4-P1.90-LS2.6-BR]  27.43 7.87 180 top
Q2  S8050  [SOT-23-3_L2.9-W1.3-P1.90-LS2.4-BR]  27.03 22.73 0 top
Q3  S8050  [SOT-23-3_L2.9-W1.3-P1.90-LS2.4-BR]  27.03 17.65 0 top
R1  10kΩ  [R0603]  34.55 23.62 0 top
R2  10kΩ  [R0603]  34.55 21.21 0 top
R3  10kΩ  [R0603]  46.92 6.6 0 top
R4  10kΩ  [R0603]  53.09 22.99 0 top
R5  3kΩ  [R0603]  34.67 7.24 0 top
R6  10kΩ  [R0603]  46.92 23.11 0 top
R7  10kΩ  [R0603]  41.53 11.94 0 top
R8  10kΩ  [R0603]  46.92 10.8 0 top
R9  10kΩ  [R0603]  46.92 15.24 0 top
SW1  SS-3292S-L2-B  [SW-SMD_SS-3292S-L2-B]  43.94 27.94 0 top
SW2  TS342A2P-WZ  [SW-SMD_L4.0-W2.9-LS5.0]  23.88 27.94 0 top
SW3  TS342A2P-WZ  [SW-SMD_L4.0-W2.9-LS5.0]  33.15 27.69 0 top
TP4054  TP4054-42-SOT25R  [SOT-23-5_L3.0-W1.7-P0.95-LS2.8-BL]  34.29 16.64 90 top
U4  CP2102-GMR  [WQFN-28_L5.0-W5.0-P0.50-BL-EP3.2]  15.19 21.36 180 top
U5  ESP32-PICO-D4  [LGA-48_L7.0-W7.0-P0.50-BL-EP5.4]  18.54 11.32 90 top
USB1  TYPE-C  [USB-C-SMD_KH-TYPE-C-16P]  5.34 23.75 270 top

## Footprints (pads in the part's own frame, mm; a bottom-side part is the same pattern mirrored in y, then rotated)
C0603
  rect 0.8x0.9 smd: 1(-0.7,0) 2(0.7,0)
CONN-SMD_2P-P2.00_HDGC_HDGC2001WR-S-2P
  rect 1x4.2 smd: 1(-1,2.85) 2(1,2.85)
  rect 1.5x3.4 smd: 3(3.75,-2.85) 4(-3.75,-2.85)
HDR-TH_4P-P2.54-V-M
  rect 1.7x1.7 hole 1.1: 1(-3.81,0)
  round 1.7 hole 1.1: 2(-1.27,0) 3(1.27,0) 4(3.81,0)
HDR-TH_7P-P2.54-V-M
  rect 1.7x1.7 hole 1.1: 1(-7.62,0)
  round 1.7 hole 1.1: 2(-5.08,0) 3(-2.54,0) 4(0,0) 5(2.54,0) 6(5.08,0) 7(7.62,0)
LED0603-RD
  rect 0.8x0.8 smd: 1(-0.799,-0.004) 2(0.799,0.004)
LGA-48_L7.0-W7.0-P0.50-BL-EP5.4
  rect 0.27x0.6 smd: 1(-2.75,-3.32) 2(-2.25,-3.32) 3(-1.75,-3.32) 4(-1.25,-3.32) 5(-0.75,-3.32) 6(-0.25,-3.32) 7(0.25,-3.32) 8(0.75,-3.32) 9(1.25,-3.32) 10(1.75,-3.32) 11(2.25,-3.32) 12(2.75,-3.32) 25(2.75,3.32) 26(2.25,3.32) 27(1.75,3.32) 28(1.25,3.32) 29(0.75,3.32) 30(0.25,3.32) 31(-0.25,3.32) 32(-0.75,3.32) 33(-1.25,3.32) 34(-1.75,3.32) 35(-2.25,3.32) 36(-2.75,3.32)
  rect 0.6x0.27 smd: 13(3.32,-2.75) 14(3.32,-2.25) 15(3.32,-1.75) 16(3.32,-1.25) 17(3.32,-0.75) 18(3.32,-0.25) 19(3.32,0.25) 20(3.32,0.75) 21(3.32,1.25) 22(3.32,1.75) 23(3.32,2.25) 24(3.32,2.75) 37(-3.32,2.75) 38(-3.32,2.25) 39(-3.32,1.75) 40(-3.32,1.25) 41(-3.32,0.75) 42(-3.32,0.25) 43(-3.32,-0.25) 44(-3.32,-0.75) 45(-3.32,-1.25) 46(-3.32,-1.75) 47(-3.32,-2.25) 48(-3.32,-2.75)
  rect 5.4x5.4 smd: 49(0,0)
R0603
  rect 0.806x0.864 smd: 1(-0.753,0) 2(0.753,0)
SOD-123_L2.8-W1.8-LS3.7-RD
  rect 0.95x1.15 smd: 1(-1.692,0) 2(1.692,0)
SOT-23-3_L2.9-W1.3-P1.90-LS2.4-BR
  rect 1.25x0.7 smd: 1(1,-0.95) 2(1,0.95) 3(-1,0)
SOT-23-3_L2.9-W1.4-P1.90-LS2.6-BR
  rect 0.91x0.6 smd: 1(1.055,-0.955) 2(1.055,0.955) 3(-1.055,0)
SOT-23-5_L3.0-W1.7-P0.95-LS2.8-BL
  rect 0.49x1.157 smd: 1(-0.95,-1.153) 2(0,-1.153) 3(0.95,-1.153)
  rect 0.49x1.175 smd: 4(0.95,1.153) 5(-0.95,1.153)
SOT-23-5_L3.0-W1.7-P0.95-LS2.8-TL
  rect 1x0.55 smd: 1(-1.272,0.95) 2(-1.272,0) 3(-1.272,-0.95) 4(1.272,-0.95) 5(1.272,0.95)
SW-SMD_L4.0-W2.9-LS5.0
  rect 1.53x1.36 smd: 1(-2.035,0) 2(2.035,0)
SW-SMD_SS-3292S-L2-B
  rect 0.9x1.25 smd: 1(-2.3,1.587) 2(0.7,1.587) 3(2.2,1.587)
  rect 0.9x0.9 smd: EH(-3.8,0.613) EH(-3.8,-1.587) EH(3.8,0.613) EH(3.8,-1.587)
USB-C-SMD_KH-TYPE-C-16P
  oval 1.2x2 hole 0.7x1.7: 1(-4.32,1.765) 2(4.32,1.765)
  oval 1.2x1.8 hole 0.7x1.4: 3(-4.32,-2.415) 4(4.32,-2.415)
  rect 0.3x1.3 smd: A1(-3.35,2.415) A4(-2.55,2.415) A5(-1.25,2.415) A6(-0.25,2.415) A7(0.25,2.415) A8(1.25,2.415) A9(2.55,2.415) A12(3.35,2.415) B1(3.05,2.415) B4(2.25,2.415) B5(1.75,2.415) B6(0.75,2.415) B7(-0.75,2.415) B8(-1.75,2.415) B9(-2.25,2.415) B12(-3.05,2.415)
WQFN-28_L5.0-W5.0-P0.50-BL-EP3.2
  oval 0.28x0.9 smd: 1(-1.502,-2.5) 2(-1.001,-2.5) 3(-0.5,-2.5) 4(0,-2.5) 5(0.5,-2.5) 6(1,-2.5) 7(1.501,-2.5) 15(1.501,2.5) 16(1,2.5) 17(0.5,2.5) 18(0,2.5) 19(-0.5,2.5) 20(-1.001,2.5) 21(-1.502,2.5)
  oval 0.9x0.28 smd: 8(2.5,-1.502) 9(2.5,-1.001) 10(2.5,-0.5) 11(2.5,0) 12(2.5,0.5) 13(2.5,1) 14(2.5,1.501) 22(-2.5,1.501) 23(-2.5,1) 24(-2.5,0.5) 25(-2.5,0) 26(-2.5,-0.5) 27(-2.5,-1.001) 28(-2.5,-1.502)
  rect 3.2x3.2 smd: 29(0,0)

## Nets
As in the schematic.

Pads without a net: H2 1; LDO1 4; SW1 1; U4 3 6 10 11 12 13 14 15 16 17 18 19 20 21 22 23 27; U5 2 5 6 7 8 10 11 12 13 16 17 18 20 21 24 25 26 27 28 29 30 31 32 33 34 35 36 38 44 45 47 48; USB1 A5 A8 B5 B8

## Via types
v1: diameter 0.61, hole 0.305, Top Layer to Bottom Layer, 73 vias

## Routing (per net, layer and track width the routed paths; a pad name or vN(x,y) marks a point on that pad's centre or on a via; arc(x,y) is an arc through that point)
3V3: length 150
  Top Layer w0.254: 20.58,7.37 20.45,7.24 19.18,7.24 18.79,7.62 U5.43 ; 20.58,7.37 22.35,7.37 22.74,7.75 22.74,8.89 ; 20.58,7.37 20.29,7.65 U5.46 ; 20.58,7.37 22.48,5.46 26.67,5.46 ; v1(25.15,10.07) 22.19,10.07 ; 22.19,10.07 22.74,9.53 22.74,8.89 ; 22.19,10.07 U5.4 U5.3 ; v1(44.45,14.99) 43.44,16 C2.2 41.66,16.58 41.66,17.65 40.83,18.48 C5.1 ; 26.8,5.21 26.8,5.33 26.67,5.46 ; v1(50.29,1.02) 46.74,1.02 45.98,1.78 H1.3 43.82,0.76 22.86,0.76 H2.2 18.8,1.02 14.99,1.02 14.61,1.4 14.61,3.05 16.68,5.12 16.68,5.48 15.75,6.41 15.75,7.95 U5.37 ; v1(35.94,5.21) 31.12,5.21 30.86,5.46 26.67,5.46 ; v1(21.85,16.38) 20.07,18.16 18.8,18.16 18.16,17.53 18.16,15.25 18.29,15.12 U5.19 ; 22.74,8.89 22.41,8.57 U5.1 ; v1(24.51,13.97) 24.51,13.53 LDO1.5 25.91,11.94 v1(26.8,11.05) ; v1(36.71,3.05) v1(38.74,3.05)
  Bottom Layer w0.254: v1(24.51,13.97) 22.1,16.38 v1(21.85,16.38) ; v1(38.74,3.05) 38.74,5.33 40.39,6.98 41.4,5.97 52.71,5.97 54.61,7.87 ; v1(50.29,1.02) 54.61,5.33 54.61,7.87 ; 54.61,7.87 54.61,12.57 53.34,13.84 45.6,13.84 v1(44.45,14.99) ; v1(25.15,10.07) 26,10.92 26.16,10.92 26.29,11.05 v1(26.8,11.05) ; v1(35.94,5.21) 35.94,3.81 v1(36.71,3.05)
GND: length 167.8
  Top Layer w0.254: v1(32.51,7.62) 33.54,7.62 R5.1 ; v1(36.83,27.43) 35.44,27.43 SW3.2 ; v1(24.26,1.52) 24.26,1.91 H2.3 ; v1(39.12,30.1) 39.12,29.58 SW1.EH SW1.EH ; 45.91,19.43 46.29,19.05 ; 45.91,19.43 45.34,20 45.34,22.29 R6.1 46.17,22.67 47.25,21.59 v1(49.53,21.59) ; 45.91,19.43 C5.2 42.23,20.64 41.28,21.59 ; 7.68,9.64 7.68,10.72 v1(12.83,15.88) 12.19,16.51 12.19,18.42 12.25,18.42 U4.29 ; v1(51.18,14.61) 51.81,15.24 LED2.1 52.67,14.95 48.52,10.8 R8.2 ; 41.28,21.59 40.01,20.32 39.12,20.32 39.12,18.29 40.83,16.58 C2.1 39.25,16 38.19,17.06 36.2,17.06 35.78,16.64 TP4054.2 ; 41.28,21.59 41.28,22.8 C1.1 40.58,22.99 v1(38.86,22.99) ; v1(28.96,9.91) 29.59,10.54 29.59,12.32 28.83,13.08 LDO1.2 ; C4.2 42.36,9.46 43.18,10.29 44.71,10.29 45.47,9.53 46.23,9.53 47.5,10.8 R8.2 ; 7.75,20.7 7.75,20.08 USB1.2 ; SW2.2 25.91,28.57 25.15,29.34 19.94,29.34 19.05,28.45 v1(17.27,28.45) ; R8.2 49.79,8.68 49.79,4.19 H1.4 ; SW1.EH SW1.EH 47.81,26.42 v1(49.53,26.42) ; U4.2 U4.1 16.7,24.82 v1(17.53,25.65) ; 1.98,4.89 1.98,3.74 2.8,2.92 v1(13.85,2.92)
  Bottom Layer w0.254: v1(38.86,22.99) 36.83,25.02 v1(36.83,27.43) 36.83,27.81 v1(39.12,30.1) ; v1(17.27,28.45) 17.53,28.19 v1(17.53,25.65) ; v1(17.54,12.32) 13.99,15.88 v1(12.83,15.88) ; v1(24.26,1.52) 24.01,1.27 15.5,1.27 v1(13.85,2.92) ; v1(51.18,14.61) 51.18,15.62 53.09,17.53 53.09,19.3 51.69,20.7 50.42,20.7 v1(49.53,21.59) v1(49.53,26.42) ; v1(32.51,7.62) 32.13,7.24 30.61,7.24 28.96,8.89 v1(28.96,9.91)
VBAT: length 51.1
  Top Layer w0.254: v1(15.62,5.72) 9.6,5.72 7.68,7.64 ; v1(34.29,19.05) 35.45,17.9 TP4054.3 ; v1(23.5,6.86) 23.62,6.86 24.64,7.87 Q1.3 30.36,7.87 32.77,10.29 39.13,10.29 R7.1 39.76,12.95 v1(34.8,12.95)
  Bottom Layer w0.254: v1(34.29,19.05) 34.29,13.46 v1(34.8,12.95) ; v1(23.5,6.86) 22.86,6.22 16.89,6.22 16.39,5.72 v1(15.62,5.72)
VBUS: length 112.3
  Top Layer w0.254: 7.75,21.5 7.75,21.2 ; 7.75,21.5 6.7,21.5 5.59,22.61 5.59,24.89 6.61,25.91 6.86,25.91 7.25,26.3 7.75,26.3 ; 7.75,21.5 7.79,21.46 10.67,21.46 12.07,22.86 U4.8 U4.7 ; 7.75,26.3 9.16,26.3 12.83,29.97 36.45,29.97 38.36,28.07 38.36,25.91 37.34,24.89 ; 7.75,26.3 7.75,26 ; 42.23,24.2 43.06,25.02 46.61,25.02 47.67,23.96 ; 42.23,24.2 C1.2 ; 42.23,24.2 42.23,24.32 41.66,24.89 37.34,24.89 ; 47.67,23.96 R6.2 ; 47.67,23.96 47.67,24.05 48.64,25.02 53.34,25.02 53.85,24.51 53.85,23 R4.2 ; 33,17.59 33.02,17.61 33.02,19.43 33.53,19.94 36.45,19.94 36.96,20.45 36.96,21.97 36.95,21.97 R1.2 36.57,24.89 37.34,24.89 ; 33,17.59 31.69,17.59 29.72,15.62 24.26,15.62 23.24,14.61 23.24,13.08 26.38,9.95 Q1.1 30.25,8.83 D1.2 ; 33,17.59 TP4054.4
VIN: length 39.8
  Top Layer w0.254: SW1.2 43.94,28.83 v1(43.94,26.42) ; LDO1.1 27.75,12.13 27.31,12.57 27.31,13.72 27.62,14.03 LDO1.3 44.96,14.03 R9.1 46.87,15.94 46.87,17.02 47.69,17.84 C3.2 47.63,19.12 v1(47.63,20.57)
  Bottom Layer w0.254: v1(47.63,20.57) 46.74,21.46 44.96,21.46 43.94,22.48 v1(43.94,26.42)
AD_VBAT: length 8
  Top Layer w0.254: C4.1 40.96,9.97 42.28,11.29 R7.2 43.43,10.8 R8.1
DATE+: length 14.4
  Top Layer w0.254: v1(15.24,25.53) 15.24,23.91 U4.4 ; v1(10.8,22.99) 10.16,22.99 10.15,23 7.75,23 7.74,22.99 6.35,22.99 5.97,23.37 5.97,23.62 6.35,24 7.75,24 7.75,24
  Bottom Layer w0.254: v1(15.24,25.53) 13.34,25.53 v1(10.8,22.99)
DATE-: length 10.9
  Top Layer w0.254: 9.02,23.5 7.76,23.5 7.75,23.5 ; 9.02,23.5 10.16,23.5 11.69,25.02 14.1,25.02 14.69,24.42 U4.5 ; 9.02,23.5 9.27,23.75 9.27,24.26 9.26,24.26 9.02,24.5 7.75,24.5
DTR: length 20.3
  Top Layer w0.254: U4.28 22.99,22.86 v1(23.88,23.75) ; v1(27.43,24.89) 28.03,24.29 Q2.2 30.04,23.68 31.12,22.61 33.9,22.61 R2.2
  Bottom Layer w0.254: v1(23.88,23.75) 26.29,23.75 v1(27.43,24.89)
EN: length 8
  Top Layer w0.254: Q3.3 24.51,17.65 23.62,16.76 23.5,16.76 23.5,15.62 22.74,14.86 22.74,13.08 22.22,12.57 U5.9
GPIO0: length 21.9
  Top Layer w0.254: U5.14 20.79,15.78 20.2,16.38 v1(19.05,16.38)
  Bottom Layer w0.254: v1(19.05,16.38) 19.05,14.1 30.23,2.92 30.86,2.92
GPIO1: length 24.6
  Top Layer w0.254: v1(35.44,3.18) 35.18,2.92 H2.7 ; v1(19.81,15.49) 20.29,15.01 U5.15
  Bottom Layer w0.254: v1(35.44,3.18) 33.91,4.7 29.47,4.7 19.81,14.35 v1(19.81,15.49)
P0: length 24.2
  Top Layer w0.254: U5.23 16.26,14.68 16.26,15.49 15.75,16 v1(15.75,16.89) ; v1(25.02,21.08) 25.02,21.72 Q2.3 26.04,22.74 26.04,25.27 28.45,27.69 SW3.1
  Bottom Layer w0.254: v1(25.02,21.08) 21.08,17.15 16,17.15 v1(15.75,16.89)
P2: length 19.7
  Top Layer w0.254: v1(16.13,27.94) 16.51,27.56 21.46,27.56 SW2.1 ; U5.22 16.77,14.67 16.77,17.02 v1(16,17.78)
  Bottom Layer w0.254: v1(16.13,27.94) 16,27.81 v1(16,17.78)
RTS: length 40.4
  Top Layer w0.254: U4.24 19.28,20.86 20.2,19.94 26.7,19.94 Q3.2 28.35,18.92 v1(29.97,18.92) ; v1(34.29,9.14) 36.07,9.14 39.88,5.33 46.4,5.33 R3.2
  Bottom Layer w0.254: v1(29.97,18.92) 29.97,13.46 v1(34.29,9.14)
RX: length 69.8
  Top Layer w0.254: U4.26 v1(23.12,21.86) ; v1(23.24,18.29) 22.48,18.29 v1(21.72,19.05) ; v1(37.59,5.84) 33.28,5.84 31.75,7.37 v1(31.75,8.26) ; U5.40 17.29,7.22 v1(17.53,6.98)
  Bottom Layer w0.254: v1(17.53,6.98) 15.24,6.98 12.7,4.45 12.7,3.05 14.99,0.76 35.69,0.76 37.59,2.67 v1(37.59,5.84) ; v1(31.75,8.26) 28.58,11.43 28.58,12.19 28.45,12.19 23.24,17.4 v1(23.24,18.29) ; v1(21.72,19.05) 23.12,20.45 v1(23.12,21.86)
SCL: length 31.7
  Top Layer w0.254: H1.2 43.44,4.19 43.06,4.57 29.97,4.57 H2.5 27.82,2.92 25.96,4.78 18.65,4.78 16.79,6.63 U5.39
SDA: length 27
  Top Layer w0.254: v1(20.45,5.59) 20.32,5.59 18.29,7.61 U5.42 ; H1.1 40.9,1.65 40.52,1.27 27.43,1.27 H2.4 v1(24.51,4.19)
  Bottom Layer w0.254: v1(24.51,4.19) 21.85,4.19 v1(20.45,5.59)
TX: length 58.4
  Top Layer w0.254: v1(21.21,20.95) 20.81,21.36 U4.25 ; U5.41 17.79,7.61 18.16,7.24 18.16,6.22 v1(18.8,5.59) ; v1(13.97,4.19) v1(10.42,4.19)
  Bottom Layer w0.254: v1(18.8,5.59) 17.4,4.19 v1(13.97,4.19) ; v1(21.21,20.95) 21.21,23.62 19.69,25.15 19.69,27.56 17.53,29.72 13.85,29.72 8.89,24.77 8.89,19.43 11.31,17.02 11.31,5.08 v1(10.42,4.19)
$1N2478: length 4.6
  Top Layer w0.254: LED1.2 54.14,20.41 52.34,22.22 R4.1
$1N2479: length 19
  Top Layer w0.254: v1(36.96,16.13) 36.52,15.69 TP4054.1 ; v1(51.82,17.65) 51.82,18.45 LED1.1
  Bottom Layer w0.254: v1(51.82,17.65) 50.29,16.13 v1(36.96,16.13)
$1N2483: length 14.2
  Top Layer w0.254: TP4054.5 32.82,15.37 v1(31.12,15.37) ; R5.2 34.06,8.61 33.3,8.61 v1(33.28,8.64) ; v1(32.01,13.21) 31.5,13.21 v1(30.36,12.06)
  Bottom Layer w0.254: v1(30.36,12.06) 30.36,11.56 v1(33.28,8.64) ; v1(31.12,15.37) 32.01,14.48 v1(32.01,13.21)
$1N2492: length 56
  Top Layer w0.254: SW1.3 51.63,29.53 55.12,26.04 55.12,14.22 v1(53.34,12.45) ; D1.1 v1(38.36,11.81) ; Q1.2 26.69,6.6 v1(28.83,6.6)
  Bottom Layer w0.254: v1(53.34,12.45) 38.99,12.45 v1(38.36,11.81) 33.15,6.6 v1(28.83,6.6)
$1N2500: length 7.5
  Top Layer w0.254: R9.2 50.55,15.24 51.44,16.13 53.72,16.13 54.27,15.58 LED2.2
$1N2512: length 34.6
  Top Layer w0.254: v1(9.78,20.45) 10.54,20.45 11.56,21.46 11.56,21.84 12.07,22.36 U4.9 ; R1.1 31.51,25.91 v1(28.45,25.91) ; v1(14.61,26.8) 17.91,26.8 19.31,25.4 v1(23.5,25.4)
  Bottom Layer w0.254: v1(14.61,26.8) 12.19,26.8 9.78,24.38 v1(9.78,20.45) ; v1(28.45,25.91) 24.01,25.91 v1(23.5,25.4)
$1N2515: length 7.6
  Top Layer w0.254: Q3.1 29.29,16.7 R2.1
$1N2518: length 29
  Top Layer w0.254: v1(44.45,11.68) 44.45,12.45 v1(43.69,13.21) ; v1(29.97,21.84) 29.91,21.78 Q2.1 ; R3.1 44.45,8.32 v1(44.45,9.53)
  Bottom Layer w0.254: v1(43.69,13.21) 38.1,13.21 35.44,15.88 35.44,19.56 33.15,21.84 v1(29.97,21.84) ; v1(44.45,9.53) v1(44.45,11.68)
